# EAGLE design DynamicRdsBoard (EAGLE 9.6.2)
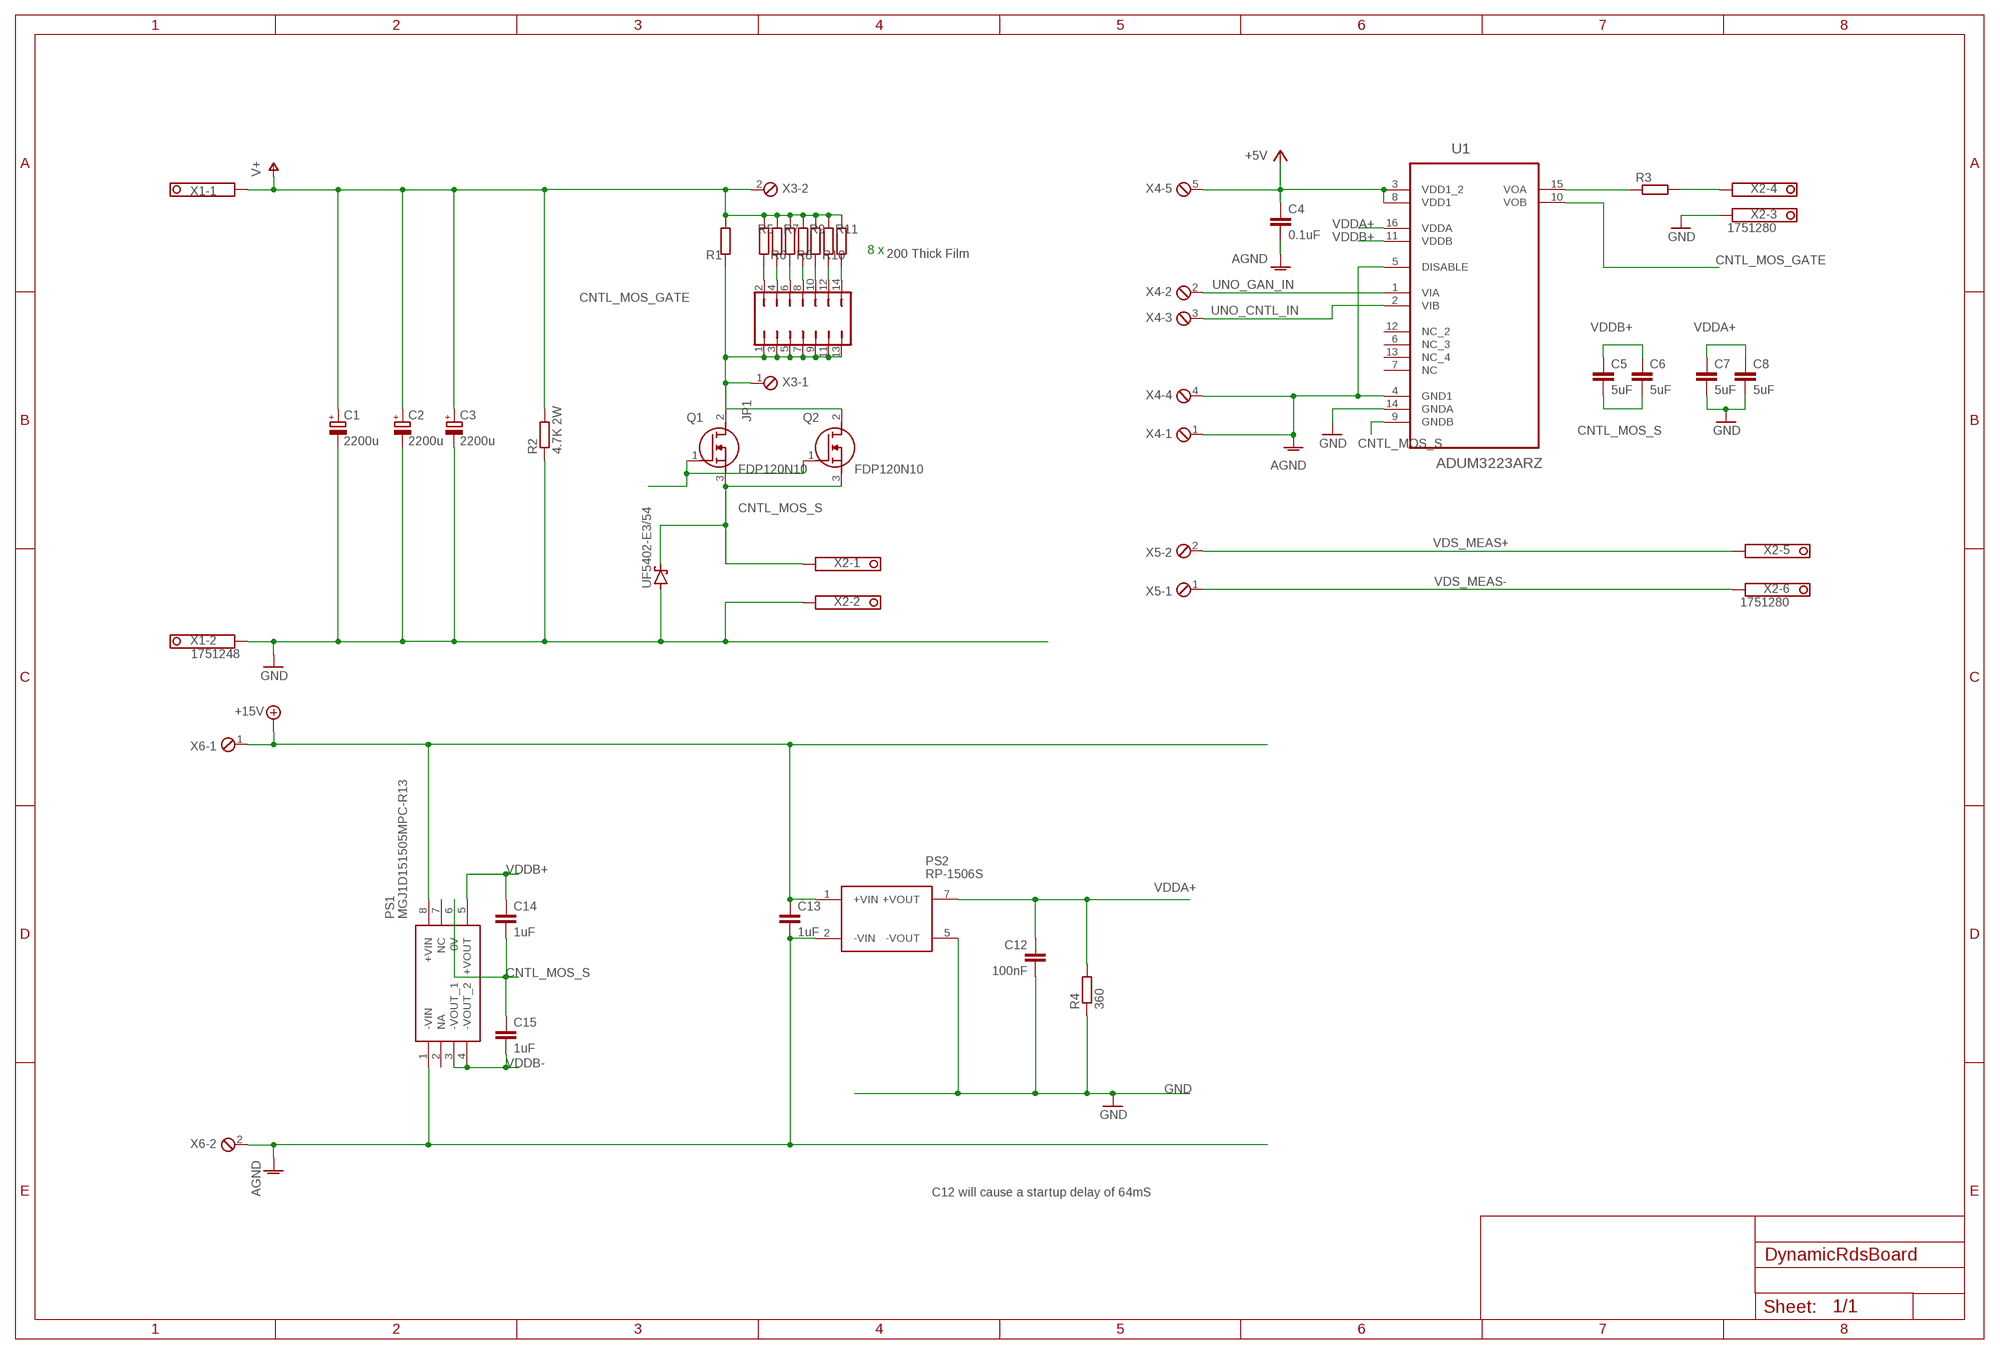
[diagram p0: schematic, sheet 1]

## Parts
C1  2200u  CPOL-EUE10-30  [EB30D]
C2  2200u  CPOL-EUE10-30  [EB30D]
C3  2200u  CPOL-EUE10-30  [EB30D]
C4  0.1uF  C-EUC0805  [C0805]
C5  5uF  C-EUC0805  [C0805]
C6  5uF  C-EUC0805  [C0805]
C7  5uF  C-EUC0805  [C0805]
C8  5uF  C-EUC0805  [C0805]
C12  100nF  C-EUC0805  [C0805]
C13  1uF  C-EUC0805  [C0805]
C14  1uF  C-EUC0805  [C0805]
C15  1uF  C-EUC0805  [C0805]
JP1  JP7Q  [JP7Q]
PS1  MGJ1D151505MPC-R13  [MGJ1D151505MPCR13]
PS2  RP-1506S  [RP1506S]
Q1  FDP120N10  [TO254P483X1016X2261-3P]
Q2  FDP120N10  [TO254P483X1016X2261-3P]
R1  200 Thick Film  R-EU_R1206  [R1206]
R2  4.7K 2W  R-EU_0309/12  [0309/12]
R3  R-EU_R0805  [R0805]
R4  360  R-EU_R0805  [R0805]
R5  200 Thick Film  R-EU_R1206  [R1206]
R6  200 Thick Film  R-EU_R1206  [R1206]
R7  200 Thick Film  R-EU_R1206  [R1206]
R8  200 Thick Film  R-EU_R1206  [R1206]
R9  200 Thick Film  R-EU_R1206  [R1206]
R10  200 Thick Film  R-EU_R1206  [R1206]
R11  200 Thick Film  R-EU_R1206  [R1206]
U1  ADUM3223ARZ  [SOIC127P600X175-16N]
UF5402-E3/54  SCHOTTKY-DIODECB429-15  [CB429-15]
X1  1751248  [1751248]
X2  1751280  [1751280]
X3  MPT2  [2POL254]
X4  MPT5  [5POL254]
X5  MPT2  [2POL254]
X6  MPT2  [2POL254]

## Nets
': R3.1 U1.15(VOA)
+5V: C4.1 U1.3(VDD1_2) U1.8(VDD1) X4.5
+15V: C13.1 PS1.8(+VIN) PS2.1(+VIN) X6.1
AGND: C4.2 C13.2 PS1.1(-VIN) PS2.2(-VIN) U1.4(GND1) U1.5(DISABLE) X4.1 X4.4 X6.2
CNTL_MOS_GATE: Q1.1(G) Q2.1(G) U1.10(VOB)
CNTL_MOS_S: C5.2 C6.2 C14.2 C15.1 PS1.6(0V) Q1.3(S) Q2.3(S) U1.9(GNDB) UF5402-E3/54.C X2.1
GAN_MOS_G: R3.2 X2.4
GND: C1.- C2.- C3.- C7.2 C8.2 C12.2 PS2.5(-VOUT) R2.1 R4.1 U1.14(GNDA) UF5402-E3/54.A X1.2 X2.2 X2.3
N$1: JP1.1 JP1.3 JP1.5 JP1.7 JP1.9 JP1.11 JP1.13 Q1.2(D) Q2.2(D) R1.1 X3.1
N$2: JP1.2 R5.1
N$3: JP1.4 R6.1
N$4: JP1.6 R7.1
N$5: JP1.8 R8.1
N$6: JP1.10 R9.1
N$7: JP1.12 R10.1
N$8: JP1.14 R11.1
UNO_CNTL_IN: U1.2(VIB) X4.3
UNO_GAN_IN: U1.1(VIA) X4.2
V+: C1.+ C2.+ C3.+ R1.2 R2.2 R5.2 R6.2 R7.2 R8.2 R9.2 R10.2 R11.2 X1.1 X3.2
VDDA+: C7.1 C8.1 C12.1 PS2.7(+VOUT) R4.2 U1.16(VDDA)
VDDB+: C5.1 C6.1 C14.1 PS1.5(+VOUT) U1.11(VDDB)
VDDB-: C15.2 PS1.3(-VOUT_1) PS1.4(-VOUT_2)
VDS_MEAS+: X2.5 X5.2
VDS_MEAS-: X2.6 X5.1
Unconnected: PS1.2(NA) PS1.7(NC) U1.6(NC_3) U1.7(NC) U1.12(NC_2) U1.13(NC_4)

## Notes on the sheet
- 8 x
- C12 will cause a startup delay of 64mS

## Library data of the parts
C1-C3 = rcl:CPOL-EU: POLARIZED CAPACITOR, European symbol; SPICEPREFIX: C
C4-C8 C12-C15 = rcl:C-EU: CAPACITOR, European symbol; SPICEPREFIX: C
JP1 = jumper:JP7Q: JUMPER
PS1 = SamacSys_Parts:MGJ1D151505MPC-R13: Isolated DC/DC Converters DC/DC 1W TH 15-15/5V 5.2KV 13" reel Source: Datasheet <https://componentsearchengine.com/Datasheets/1/MGJ1D151505MPC-R13.pdf>; DESCRIPTION: Isolated DC/DC Converters DC/DC 1W TH 15-15/5V 5.2KV 13" reel; HEIGHT: 4.86mm; MANUFACTURER_NAME: Murata Electronics; MANUFACTURER_PART_NUMBER: MGJ1D151505MPC-R13; MOUSER_PART_NUMBER: 580-MGJ1D151505MPC13; MOUSER_PRICE-STOCK: https://www.mouser.co.uk/ProductDetail/Murata-Power-Solutions/MGJ1D151505MPC-R13?qs=zOfyGkaCkAULT8%252BmoS2WGw%3D%3D
PS2 = SamacSys_Parts:RP-1506S: Isolated DC/DC Converters 1W 15Vin 6Vout 167mA SIP7 Source: Datasheet <https://www.arrow.com/en/products/rp-1506s/recom-power>; DESCRIPTION: Isolated DC/DC Converters 1W 15Vin 6Vout 167mA SIP7; HEIGHT: 10.7mm; MANUFACTURER_NAME: RECOM Power; MANUFACTURER_PART_NUMBER: RP-1506S; RS_PART_NUMBER: 1655101; RS_PRICE-STOCK: https://uk.rs-online.com/web/p/products/1655101
Q1 Q2 = SamacSys_Parts:FDP120N10: MOSFET PowerTrench N-Ch 100V 74A TO220 Source: Datasheet <https://www.onsemi.com/pub/Collateral/FDP120N10-D.pdf>; DESCRIPTION: MOSFET PowerTrench N-Ch 100V 74A TO220; HEIGHT: 4.83mm; MANUFACTURER_NAME: ON Semiconductor; MANUFACTURER_PART_NUMBER: FDP120N10; MOUSER_PART_NUMBER: 512-FDP120N10; MOUSER_PRICE-STOCK: https://www.mouser.co.uk/ProductDetail/ON-Semiconductor-Fairchild/FDP120N10/?qs=3k%252ByHIYxWHuxbymkHZSEyA%3D%3D
R1-R11 = rcl:R-EU_: RESISTOR, European symbol; SPICEPREFIX: R
U1 = ADUM3223ARZ:ADUM3223ARZ: Precision Half-Bridge Driver Check prices <https://pricing.snapeda.com/parts/ADUM3223ARZ/Analog%20Devices/view-part?ref=eda>; AVAILABILITY: Warning; DESCRIPTION: 4A Gate Driver Magnetic Coupling 3000Vrms 2 Channel 16-SOIC; MF: Analog Devices; MP: ADUM3223ARZ; PACKAGE: SOIC-16 Analog Devices; PRICE: None; PURCHASE-URL: https://pricing.snapeda.com/search/part/ADUM3223ARZ/?ref=eda
UF5402-E3/54 = diode:SCHOTTKY-DIODE: Schottky Diode
X1 = con-phoenix-350:1751248: MKDS 1/ 2-3,5 Printklemme Nennstrom: 10 A Bemessungsspannung: 160 V Raster: 3,5 mm Polzahl: 2 Montageart: Löten Anschlussart: Schraubanschluss Anschlussrichtung vom Leiter zur Platine: 0° Source: http://eshop.phoenixcontact.com .. 1751248.pdf; OC_FARNELL: unknown; OC_NEWARK: unknown
X2 = con-phoenix-350:1751280: MKDS 1/ 6-3,5 Printklemme Nennstrom: 10 A Bemessungsspannung: 160 V Raster: 3,5 mm Polzahl: 6 Montageart: Löten Anschlussart: Schraubanschluss Anschlussrichtung vom Leiter zur Platine: 0° Source: http://eshop.phoenixcontact.com .. 1751280.pdf; MPN: 1751280; OC_FARNELL: unknown; OC_NEWARK: 27R1765
X3 X5 X6 = con-phoenix-254:MPT2: PHOENIX CONNECTOR; OC_FARNELL: unknown; OC_NEWARK: unknown
X4 = con-phoenix-254:MPT5: PHOENIX CONNECTOR; OC_FARNELL: unknown; OC_NEWARK: unknown

## Board
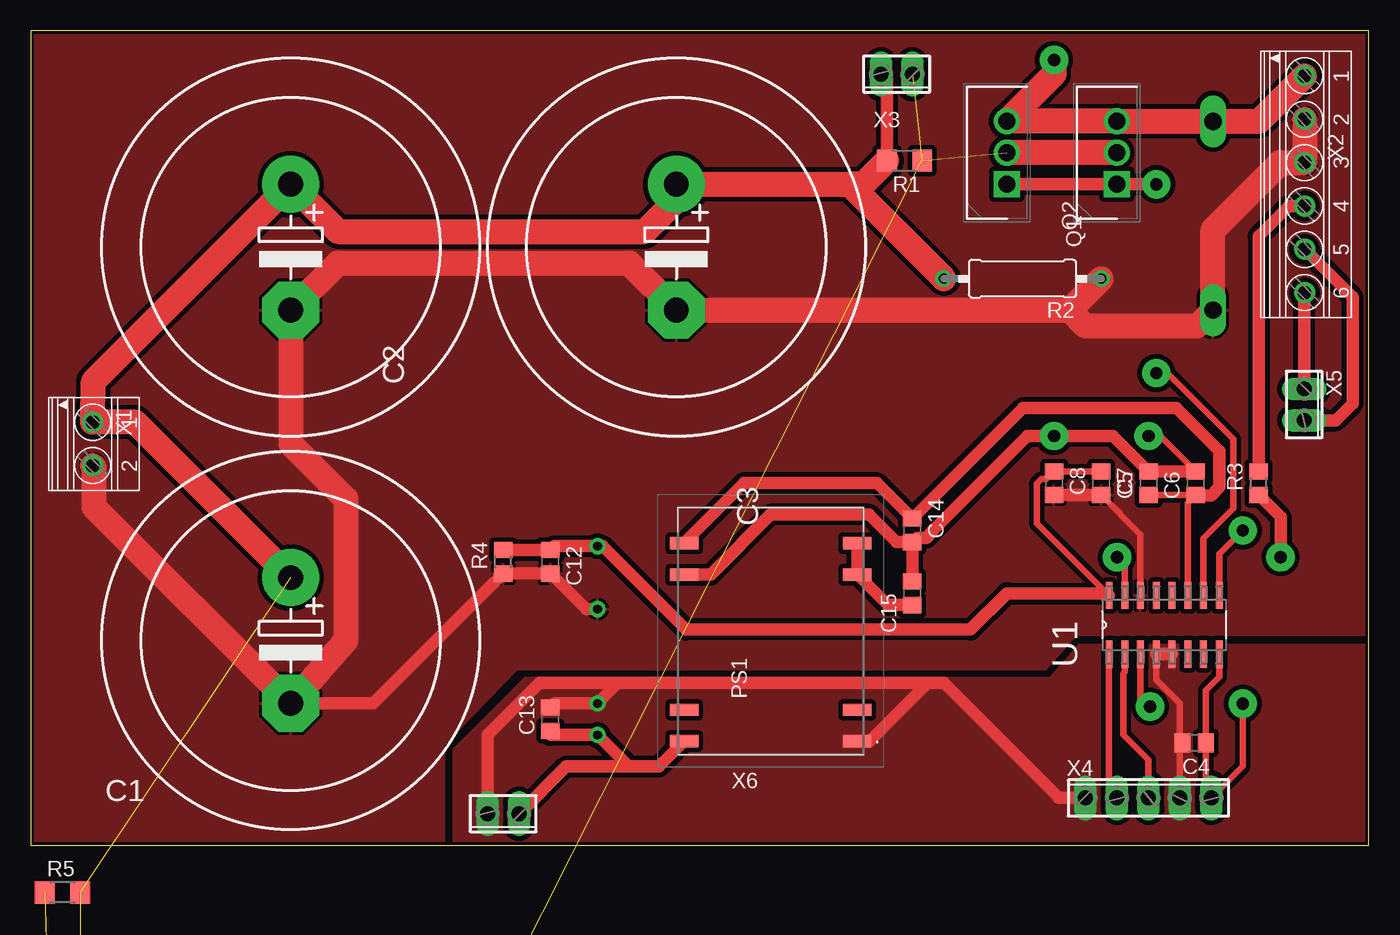
[diagram p1: board, top side]
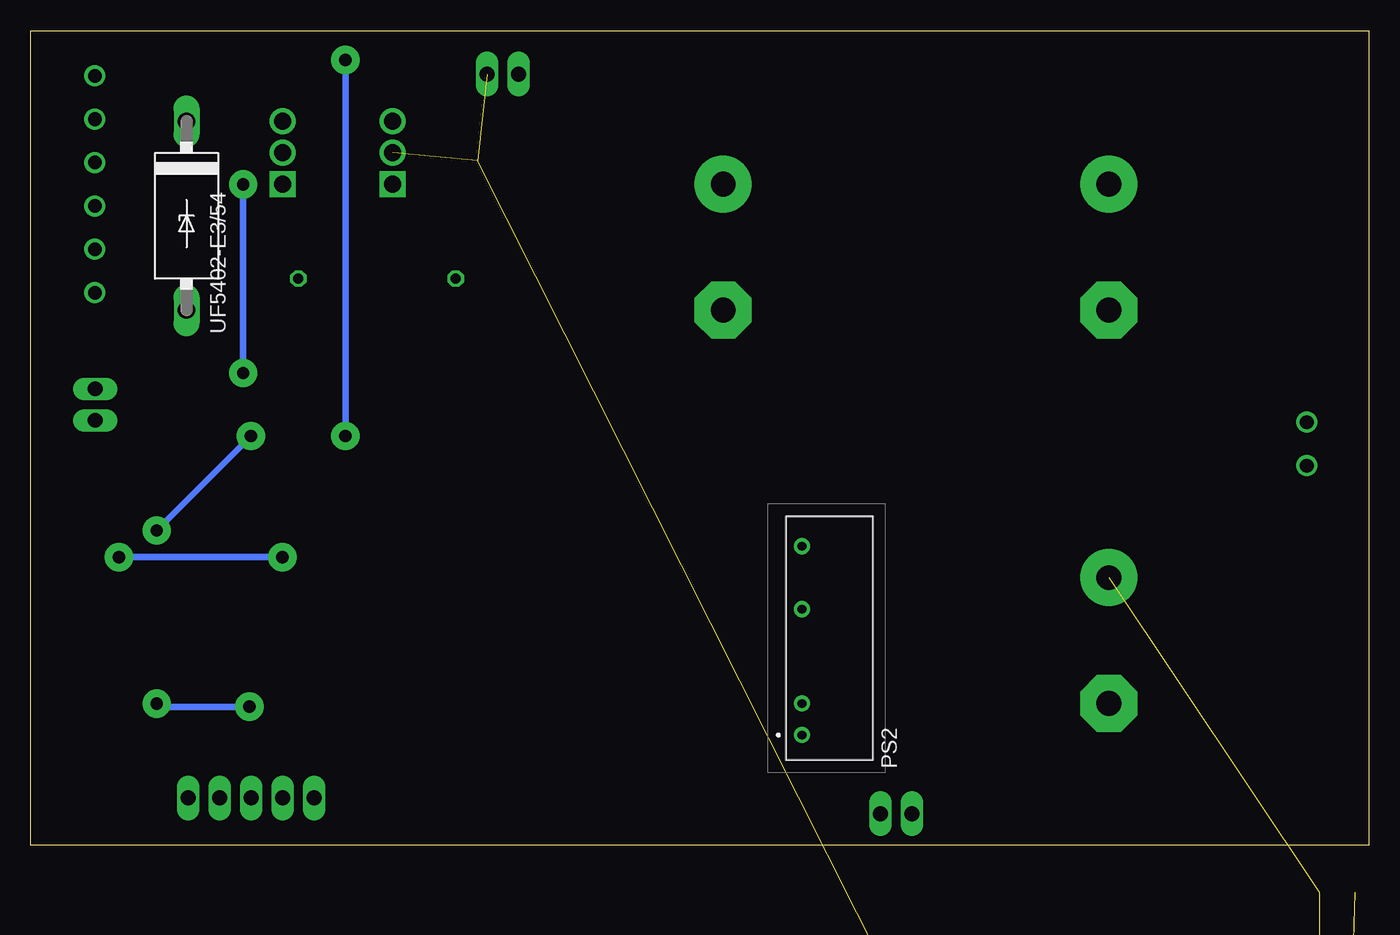
[diagram p2: board, bottom side, seen from below]

Size 107.93 x 65.71 mm. Coordinates in mm from the lower left corner, seen from the top.
Outline: 0,0 107.93,0 107.93,65.71 0,65.71 0,0
Copper layers (1*16): Top 0.035mm / dielectric 1.5mm / Bottom 0.035mm
Design rules "quickteck *": minimum track width 6mil, minimum drill 10mil, track to track 15mil, track to pad 15mil, pad to pad 15mil, via to via 15mil, smd to smd 0mil, copper to edge 10mil, drill to drill 10mil, minimum pad ring 10mil, minimum via ring 10mil, stop-mask expansion 3mil, vias tented up to drill 0mil, thermal gap 10mil

### Footprints (pad centres in the part's own frame; a part is rotated, then mirrored left to right if it is on the bottom)
EB30D = drill 2.007 pad 4.597: + -5.08,0 | drill 2.007 pad 4.597 octagon: - 5.08,0
C0805 = smd 1.3 x 1.5: 1 -0.95,0; 2 0.95,0
JP7Q = drill 0.914 octagon: 1 -7.62,-1.27; 2 -7.62,1.27; 3 -5.08,-1.27; 4 -5.08,1.27; 5 -2.54,-1.27; 6 -2.54,1.27; 7 0,-1.27; 8 0,1.27; 9 2.54,-1.27; 10 2.54,1.27; 11 5.08,-1.27; 12 5.08,1.27; 13 7.62,-1.27; 14 7.62,1.27
MGJ1D151505MPCR13 = smd 1 x 2.3: 1 -8.89,-6.985; 2 -6.35,-6.985; 3 4.57,-6.985; 4 7.11,-6.985; 5 7.11,6.985; 6 4.57,6.985; 7 -6.35,6.985; 8 -8.89,6.985
RP1506S = drill 0.7 pad 1.303: 1 0,0; 2 2.54,0; 5 10.16,0; 7 15.24,0
TO254P483X1016X2261-3P = drill 1.39 pad 2.085 square: 1 0,0 | drill 1.39 pad 2.085: 2 2.54,0; 3 5.08,0
R1206 = smd 1.6 x 1.803: 1 -1.422,0; 2 1.422,0
0309/12 = drill 0.813 octagon: 1 -6.35,0; 2 6.35,0
R0805 = smd 1.3 x 1.5: 1 -0.95,0; 2 0.95,0
SOIC127P600X175-16N = smd 2.184 x 0.559: 1 -2.362,4.445; 2 -2.362,3.175; 3 -2.362,1.905; 4 -2.362,0.635; 5 -2.362,-0.635; 6 -2.362,-1.905; 7 -2.362,-3.175; 8 -2.362,-4.445; 9 2.362,-4.445; 10 2.362,-3.175; 11 2.362,-1.905; 12 2.362,-0.635; 13 2.362,0.635; 14 2.362,1.905; 15 2.362,3.175; 16 2.362,4.445
CB429-15 = drill 1.397 long: A 7.62,0; C -7.62,0
1751248 = drill 1.1 pad 1.7: 1 -1.75,-0.1; 2 1.75,-0.1
1751280 = drill 1.1 pad 1.7: 1 -8.75,-0.1; 2 -5.25,-0.1; 3 -1.75,-0.1; 4 1.75,-0.1; 5 5.25,-0.1; 6 8.75,-0.1
2POL254 = drill 1.2 long: 1 -1.27,0; 2 1.27,0
5POL254 = drill 1.2 long: 1 -5.08,0; 2 -2.54,0; 3 0,0; 4 2.54,0; 5 5.08,0

### Placement (x,y rotation side)
C1  20.95,16.51 270 top
C2  20.95,48.26 270 top
C3  52.07,48.26 270 top
C4  93.85,8.26 180 top
C5  90.17,29.21 90 top
C6  93.98,29.21 90 top
C7  86.36,29.21 270 top
C8  82.55,29.21 270 top
C12  41.91,22.86 270 top
C13  41.91,10.16 90 top
C14  71.12,25.4 270 top
C15  71.12,20.32 270 top
JP1  10.16,-50.8 0 top  (outside the outline)
PS1  59.69,17.27 90 top
PS2  45.72,8.89 90 bottom
Q1  78.74,53.34 90 top
Q2  87.63,53.34 90 top
R1  70.48,55.24 180 top
R2  80.01,45.72 180 top
R3  99.06,29.21 90 top
R4  38.1,22.86 90 top
R5  2.54,-3.81 0 top  (outside the outline)
R6  2.54,-10.16 0 top  (outside the outline)
R7  2.54,-16.51 0 top  (outside the outline)
R8  2.54,-22.86 0 top  (outside the outline)
R9  2.54,-29.21 0 top  (outside the outline)
R10  2.54,-35.56 0 top  (outside the outline)
R11  2.54,-41.91 0 top  (outside the outline)
U1  91.44,17.78 90 top
UF5402-E3/54  95.38,50.8 270 bottom
X1  5.08,32.38 270 top
X2  102.87,53.34 270 top
X3  69.85,62.23 180 top
X4  90.17,3.81 0 top
X5  102.74,35.56 270 top
X6  38.1,2.54 180 top

### Tracks (layer width: path | path; a pad name or v marks a point on that pad's centre or on a via)
'  (via drill 1 pad 2.29)
  Top 0.508: v87.63,23.24 88.27,22.61 U1.15
  Top 1.016: R3.1 100.84,26.48 v100.84,23.24
  Bottom 0.508: v100.84,23.24 v87.63,23.24
+5V  (via drill 1 pad 2.29)
  Top 0.508: U1.8 95.89,13.59 94.8,12.51 C4.1 94.8,4.26 X4.5 97.79,6.35 v97.79,11.43 | U1.3 89.53,11.81 v90.3,11.18
  Bottom 0.508: v97.79,11.43 97.54,11.18 v90.3,11.18
+15V
  Top 1.016: PS1.8 50.67,6.35 48.26,6.35 | 48.26,6.35 PS2.1 41.91,8.89 C13.1 | X6.1 43.18,6.35 48.26,6.35
AGND
  Top 0.508: X4.4 92.71,8.06 | 92.71,8.06 C4.2 | 67.67,8.38 PS1.1 | 92.71,8.06 92.71,11.43 90.81,13.34 U1.4
  Top 1.016: 72.39,13.1 67.67,8.38 | C13.2 42.23,11.43 PS2.2 47.39,13.1 | 72.39,13.1 47.39,13.1 | X6.2 36.83,8.89 41.04,13.1 47.39,13.1 | 72.39,13.1 73.66,13.1 82.95,3.81 X4.1 | U1.5 U1.4
  pour Top (rank 2, no thermals): 84.55,16.26 107.95,16.26 107.95,0 34.04,0 34.04,7.75 39.88,13.59 82.22,13.59
CNTL_MOS_GATE  (via drill 1 pad 2.29)
  Top 0.508: U1.10 94.61,24.77 97.03,27.18 97.03,32.77 91.69,38.1 v90.81,38.1
  Top 1.016: Q1.1 Q2.1 v90.81,53.34
  Bottom 0.508: v90.81,53.34 v90.81,38.1
CNTL_MOS_S  (via drill 1 pad 2.29)
  Top 0.508: U1.9 95.89,23.5 v97.79,25.4 | C6.2 91.12,33.02 v90.17,33.02
  Top 1.016: C15.1 C14.2 | PS1.6 54.86,21.84 59.69,26.67 67.63,26.67 69.85,24.45 C14.2 | C14.2 71.48,24.81 72.24,24.81 72.76,25.33 72.76,25.37 80.41,33.02 v82.55,33.02 87.31,33.02 C5.2 C6.2
  Top 2.032: v82.55,63.37 82.55,62.23 Q1.3 Q2.3 UF5402-E3/54.C 99.1,58.42 X2.1
  Bottom 0.508: v82.55,63.37 v82.55,33.02 | v97.79,25.4 v90.17,33.02
GAN_MOS_G
  Top 1.016: R3.2 99.06,49.15 101.5,51.59 X2.4
GND
  Top 0.508: U1.14 89.53,25.09 C7.2
  Top 1.016: C8.2 C7.2 | C1.- 27.62,11.43 R4.1 C12.2 44.77,19.05 PS2.5
  Top 2.032: 83.82,43.18 C3.- 48.26,46.99 24.77,46.99 C2.- 20.95,32.38 25.4,27.94 25.4,16.51 C1.- 5.08,27.3 5.08,30.54 X1.2 | X2.2 X2.3 100.81,55.09 95.38,49.66 UF5402-E3/54.A 94.11,41.91 85.09,41.91 83.82,43.18 | 83.82,43.18 R2.1
  pour Top (rank 2): 0.13,65.66 107.82,65.66 107.82,16.89 84.35,16.89 81.9,14.1 39.24,14.1 33.4,8.09 33.4,0 0.13,0
N$1  (9 unrouted)
  Top 2.032: Q2.2 Q1.2
N$2  (1 unrouted)
N$3  (1 unrouted)
N$4  (1 unrouted)
N$5  (1 unrouted)
N$6  (1 unrouted)
N$7  (1 unrouted)
N$8  (1 unrouted)
UNO_CNTL_IN
  Top 0.508: U1.2 88.27,13.97 88.16,13.87 88.16,8.89 90.17,6.88 X4.3
UNO_GAN_IN
  Top 0.508: X4.2 87,4.45 U1.1
V+  (7 unrouted)
  Top 1.016: X3.2 69.08,61.73 R1.2
  Top 1.27: 52.07,52.07 C3.+
  Top 2.032: 52.07,52.07 49.53,49.53 24.77,49.53 C2.+ 5.03,37.41 X1.1 8.41,34.13 C1.+ | C3.+ 66.04,53.34 | 66.04,53.34 R2.2 | R1.2 67.18,53.34 66.04,53.34
VDDA+
  Top 0.508: C7.1 C8.1 81.94,29.55 81.54,29.55 81.17,29.17 81.17,25.97 U1.16
  Top 1.016: R4.2 C12.1 42.23,24.13 PS2.7 46.12,24.13 52.85,17.4 75.82,17.4 78.74,20.32 86.82,20.32 U1.16
VDDB+
  Top 0.508: U1.11 93.34,27.62 C6.1 C5.1
  Top 1.016: PS1.5 57.53,29.21 68.26,29.21 C14.1 80.04,35.27 92.41,35.27 95.87,31.81 95.87,28.89 95.22,28.24 94,28.24 C6.1
VDDB-
  Top 1.016: PS1.4 PS1.3 69.15,19.37 C15.2
VDS_MEAS+
  Top 1.016: X2.5 106.64,44.22 106.64,35.65 105.28,34.29 X5.2
VDS_MEAS-
  Top 1.016: X5.1 102.74,44.56 X2.6